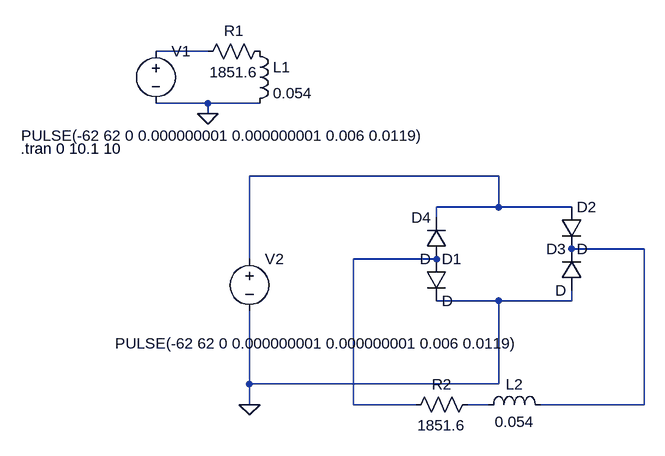
[diagram p0: schematic Draft2.asc]
Draft2.asc, the LTspice schematic file:
Version 4
SHEET 1 880 704
WIRE 192 112 112 112
WIRE 192 192 112 192
WIRE 272 192 192 192
WIRE 192 208 192 192
WIRE 640 304 256 304
WIRE 640 352 640 304
WIRE 640 352 544 352
WIRE 752 352 640 352
WIRE 544 368 544 352
WIRE 864 416 752 416
WIRE 256 432 256 304
WIRE 544 432 416 432
WIRE 640 496 544 496
WIRE 752 496 752 480
WIRE 752 496 640 496
WIRE 256 624 256 512
WIRE 640 624 640 496
WIRE 640 624 256 624
WIRE 256 656 256 624
WIRE 416 656 416 432
WIRE 512 656 416 656
WIRE 624 656 592 656
WIRE 864 656 864 416
WIRE 864 656 704 656
FLAG 192 208 0
FLAG 256 656 0
SYMBOL res 288 96 R90
WINDOW 0 0 56 VBottom 2
WINDOW 3 32 56 VTop 2
SYMATTR InstName R1
SYMATTR Value 1851.6
SYMBOL ind 256 96 R0
SYMATTR InstName L1
SYMATTR Value 0.054
SYMBOL voltage 112 96 R0
WINDOW 3 -207 146 Left 2
SYMATTR InstName V1
SYMATTR Value PULSE(-62 62 0 0.000000001 0.000000001 0.006 0.0119)
SYMBOL voltage 256 416 R0
WINDOW 3 -207 146 Left 2
SYMATTR InstName V2
SYMATTR Value PULSE(-62 62 0 0.000000001 0.000000001 0.006 0.0119)
SYMBOL diode 528 432 R0
SYMATTR InstName D1
SYMBOL diode 736 352 R0
SYMATTR InstName D2
SYMBOL diode 768 480 R180
WINDOW 0 24 64 Left 2
WINDOW 3 24 0 Left 2
SYMATTR InstName D3
SYMBOL diode 560 432 R180
WINDOW 0 24 64 Left 2
WINDOW 3 24 0 Left 2
SYMATTR InstName D4
SYMBOL res 608 640 R90
WINDOW 0 0 56 VBottom 2
WINDOW 3 32 56 VTop 2
SYMATTR InstName R2
SYMATTR Value 1851.6
SYMBOL ind 608 672 R270
WINDOW 0 32 56 VTop 2
WINDOW 3 5 56 VBottom 2
SYMATTR InstName L2
SYMATTR Value 0.054
TEXT -96 262 Left 2 !.tran 0 10.1 10

The netlist it stands for:
* Draft2.asc
R1 P001 N001 1851.6
L1 P001 0 0.054
V1 N001 0 PULSE(-62 62 0 0.000000001 0.000000001 0.006 0.0119)
V2 N002 0 PULSE(-62 62 0 0.000000001 0.000000001 0.006 0.0119)
D1 N004 0 D
D2 N002 N003 D
D3 0 N003 D
D4 N004 N002 D
R2 N005 N004 1851.6
L2 N005 N003 0.054
.model D D
.lib standard.dio
.tran 0 10.1 10
.backanno
.end